# EAGLE design breakout_v0.5 (EAGLE 9.5.0)
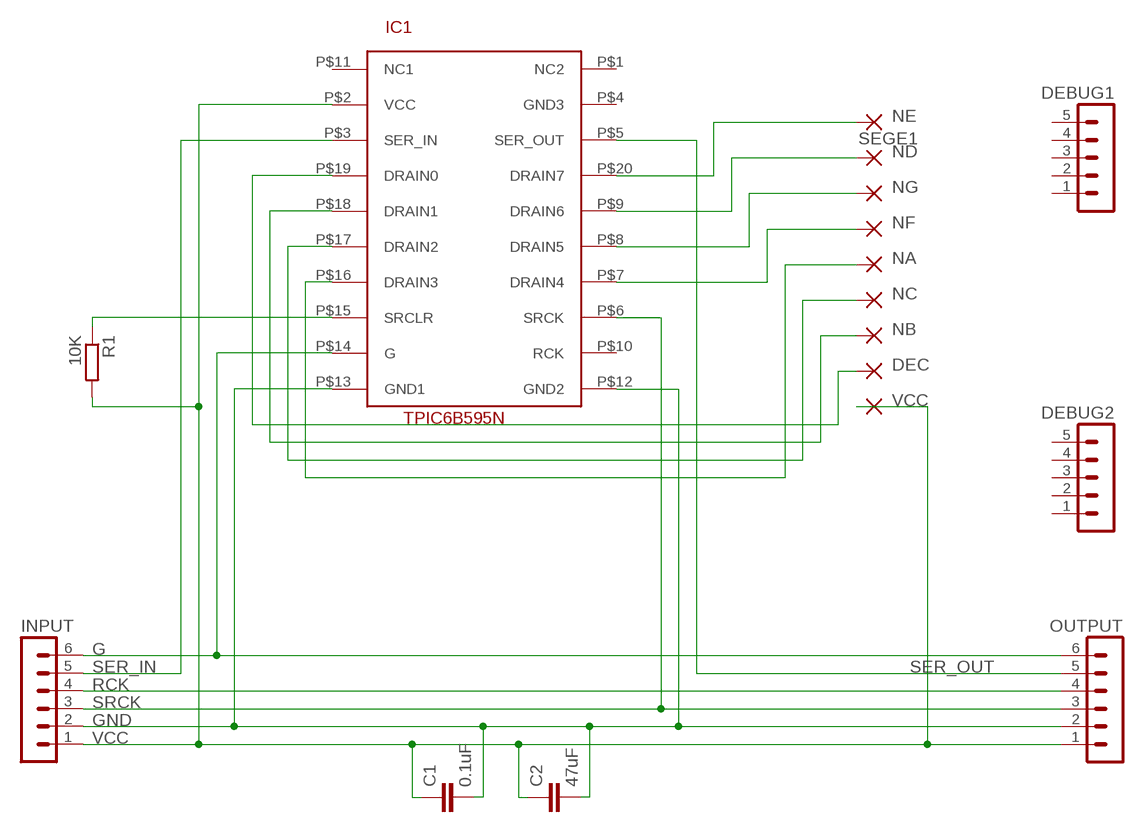
[diagram p0: schematic, sheet 1]

## Parts
C1  0.1uF  RCL_C-EU025-025X050  [RCL_C025-025X050]
C2  47uF  RCL_C-EU025-025X050  [RCL_C025-025X050]
DEBUG1  MA05-1  [MA05-1]
DEBUG2  MA05-1  [MA05-1]
DEC1  1,6/0,8  [1,6/0,8]
INPUT  CON-LSTB_MA06-1  [CON-LSTB_MA06-1]
OUTPUT  CON-LSTB_MA06-1  [CON-LSTB_MA06-1]
R1  10K  RCL_R-EU_0207/7  [RCL_0207/7]
SEGA1  1,6/0,8  [1,6/0,8]
SEGB1  1,6/0,8  [1,6/0,8]
SEGC1  1,6/0,8  [1,6/0,8]
SEGD1  1,6/0,8  [1,6/0,8]
SEGE1  1,6/0,8  [1,6/0,8]
SEGF1  1,6/0,8  [1,6/0,8]
SEGG1  1,6/0,8  [1,6/0,8]
U$1  TPIC6B595N_TPIC6B595NPDIP-20  [TPIC6B595N_PDIP-20]
VCC1  1,6/0,8  [1,6/0,8]

## Nets
DEC: U$1.P$19(DRAIN0) VCC1.1(P)
G: INPUT.6 OUTPUT.6 U$1.P$14(G)
GND [ground]: C1.2 C2.2 INPUT.2 OUTPUT.2 U$1.P$12(GND2) U$1.P$13(GND1)
N$1: R1.1 U$1.P$15(SRCLR)
NA: SEGC1.1(P) U$1.P$16(DRAIN3)
NB: DEC1.1(P) U$1.P$18(DRAIN1)
NC: SEGB1.1(P) U$1.P$17(DRAIN2)
ND: SEGG1.1(P) U$1.P$9(DRAIN6)
NE: SEGE1.1(P) U$1.P$20(DRAIN7)
NF: SEGA1.1(P) U$1.P$7(DRAIN4)
NG: SEGF1.1(P) U$1.P$8(DRAIN5)
RCK: INPUT.4 OUTPUT.4
SER_IN: INPUT.5 U$1.P$3(SER_IN)
SER_OUT: OUTPUT.5 U$1.P$5(SER_OUT)
SRCK: INPUT.3 OUTPUT.3 U$1.P$6(SRCK)
VCC [vcc]: C1.1 C2.1 INPUT.1 OUTPUT.1 R1.2 SEGD1.1(P) U$1.P$2(VCC)
Unconnected: DEBUG1.1 DEBUG1.2 DEBUG1.3 DEBUG1.4 DEBUG1.5 DEBUG2.1 DEBUG2.2 DEBUG2.3 DEBUG2.4 DEBUG2.5 U$1.P$1(NC2) U$1.P$4(GND3) U$1.P$10(RCK) U$1.P$11(NC1)

## Library data of the parts
C1 C2 = v0.4:RCL_C-EU: CAPACITOR, European symbol; SPICEPREFIX: C
DEBUG1 DEBUG2 = con-lstb:MA05-1: PIN HEADER; OC_FARNELL: unknown; OC_NEWARK: unknown
DEC1 SEGA1 SEGB1 SEGC1 SEGD1 SEGE1 SEGF1 SEGG1 VCC1 = wirepad:1,6/0,8: THROUGH-HOLE PAD
INPUT OUTPUT = v0.4:CON-LSTB_MA06-1: PIN HEADER; OC_FARNELL: unknown; OC_NEWARK: unknown
R1 = v0.4:RCL_R-EU_: RESISTOR, European symbol; SPICEPREFIX: R
U$1 = v0.4:TPIC6B595N_TPIC6B595N

## Net classes
0 default: width 0.635 mm
1 vcc: width 1.27 mm
2 ground: width 1.27 mm

## Board
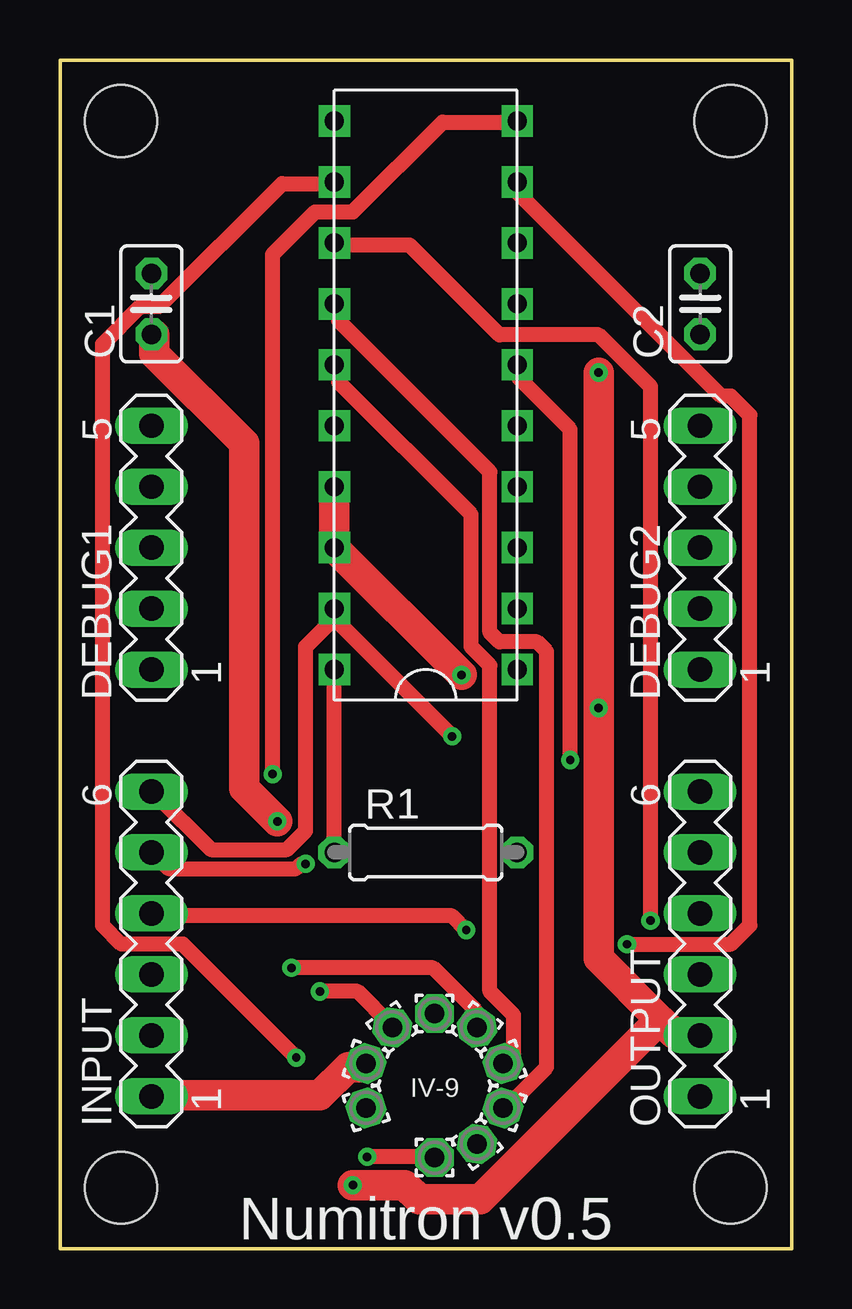
[diagram p1: board, top side]
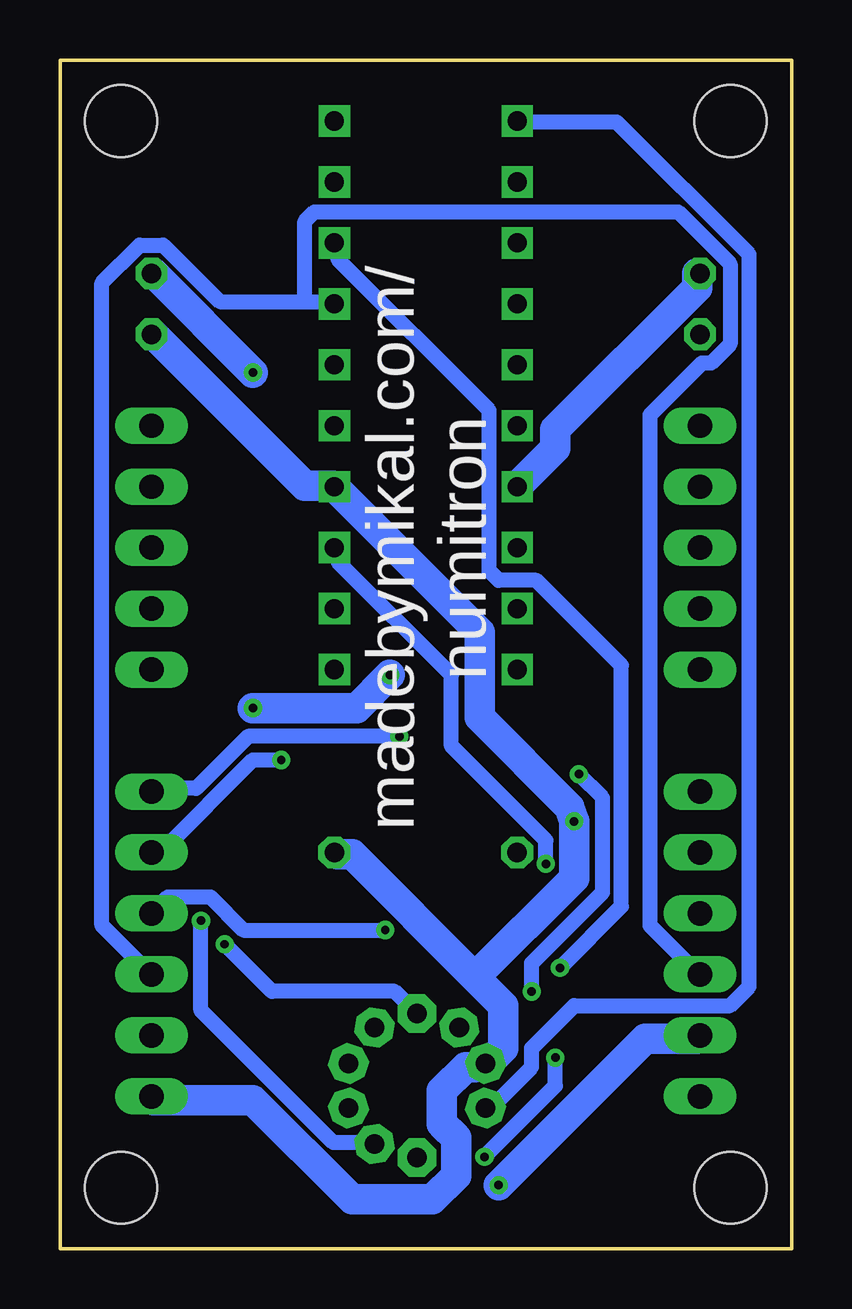
[diagram p2: board, bottom side, seen from below]

Size 30.48 x 49.53 mm. Coordinates in mm from the lower left corner, seen from the top.
Outline: 0,0 0,49.53 30.48,49.53 30.48,0 0,0
Copper layers (1*16): Top 0.035mm / dielectric 1.5mm / Bottom 0.035mm
Design rules "default": minimum track width 6mil, minimum drill 0.35mm, track to track 6mil, track to pad 6mil, pad to pad 6mil, via to via 6mil, smd to smd 6mil, copper to edge 40mil, drill to drill 6mil, minimum pad ring 10mil, minimum via ring 8mil, stop-mask expansion 4mil, vias tented up to drill 0mil, thermal gap 10mil
Holes 3 mm at 2.54,2.54 27.94,2.54 27.94,46.99 2.54,46.99

### Footprints (pad centres in the part's own frame; a part is rotated, then mirrored left to right if it is on the bottom)
RCL_C025-025X050 = drill 0.813 octagon: 1 -1.27,0; 2 1.27,0
MA05-1 = drill 1.016 long: 1 -5.08,0; 2 -2.54,0; 3 0,0; 4 2.54,0; 5 5.08,0
1,6/0,8 = drill 0.813 pad 1.6 octagon: 1 0,0
CON-LSTB_MA06-1 = drill 1.016 long: 1 -6.35,0; 2 -3.81,0; 3 -1.27,0; 4 1.27,0; 5 3.81,0; 6 6.35,0
RCL_0207/7 = drill 0.813 octagon: 1 -3.81,0; 2 3.81,0
TPIC6B595N_PDIP-20 = drill 0.8 square: P$1 -3.81,1.27; P$2 -3.81,3.81; P$3 -3.81,6.35; P$4 -3.81,8.89; P$5 -3.81,-1.27; P$6 -3.81,-3.81; P$7 -3.81,-6.35; P$8 -3.81,-8.89; P$9 -3.81,-11.43; P$10 -3.81,11.43; P$11 3.81,1.27; P$12 3.81,3.81; P$13 3.81,6.35; P$14 3.81,8.89; P$15 3.81,11.43; P$16 3.81,-1.27; P$17 3.81,-3.81; P$18 3.81,-6.35; P$19 3.81,-8.89; P$20 3.81,-11.43

### Placement (x,y rotation side)
C1  3.81,39.37 90 top
C2  26.67,39.37 90 top
DEBUG1  3.81,29.21 90 top
DEBUG2  26.67,29.21 90 top
DEC1  17.37,4.37 306 top
INPUT  3.81,12.7 90 top
OUTPUT  26.67,12.7 90 top
R1  15.24,16.51 0 top
SEGA1  17.37,9.22 144 top
SEGB1  18.46,5.87 342 top
SEGC1  18.46,7.72 18 top
SEGD1  12.75,7.72 162 top
SEGE1  12.75,5.87 198 top
SEGF1  15.61,9.79 90 top
SEGG1  13.84,9.22 126 top
U$1  15.24,35.56 180 top
VCC1  15.61,3.79 270 top

### Tracks (layer width: path | path; a pad name or v marks a point on that pad's centre or on a via)
DEC  (via drill 0.35)
  Top 0.635: v9.84,7.96 5.12,12.69 2.56,12.69 1.77,13.47 1.77,37.69 3.35,39.26 4.13,39.26 9.25,44.38 11.42,44.38 U$1.P$19 | v12.79,3.83 15.55,3.83 VCC1.1
  Bottom 0.635: v9.84,7.96 9.84,6.78 v12.79,3.83
G  (via drill 0.35)
  Top 0.635: INPUT.6 3.94,18.99 6.3,16.62 9.45,16.62 10.24,17.41 10.24,25.09 11.42,26.27 11.42,26.66 U$1.P$14 11.61,26.07 v16.34,21.35
  Bottom 0.635: v16.34,21.35 22.64,21.35 24.8,19.18 26.57,19.18 OUTPUT.6
GND  (via drill 0.35)
  Top 1.27: U$1.P$12 11.42,31.59 11.42,29.22 U$1.P$13 v16.73,23.91 | v22.44,36.51 v22.44,22.53 22.44,12.1 25,9.54 | 25,9.54 25.59,8.95 26.57,8.95 OUTPUT.2 | v12.21,2.65 14.37,2.65 14.96,2.06 17.52,2.06 25,9.54
  Bottom 1.27: C1.2 3.94,40.64 3.94,40.05 9.84,34.14 9.84,33.36 11.42,31.78 U$1.P$12 | v22.44,36.51 26.57,40.64 C2.2 | v12.21,2.65 6.1,8.75 3.94,8.75 INPUT.2 | v16.73,23.91 18.11,22.53 v22.44,22.53
N$1
  Top 0.635: U$1.P$15 11.42,24.11 11.42,16.62 R1.1
NA
  Top 0.635: U$1.P$16 11.61,36.7 11.61,36.11 17.13,30.6 17.13,25.09 17.91,24.3 17.91,10.72 18.9,9.73 18.9,8.16 18.5,7.77 SEGC1.1
NB  (via drill 0.35)
  Top 0.635: v24.61,13.67 24.61,35.92 22.44,38.08 18.31,38.08 14.57,41.82 11.61,41.82 U$1.P$18
  Bottom 0.635: v24.61,13.67 24.61,9.93 19.09,4.42 17.52,4.42 DEC1.1
NC
  Top 0.635: U$1.P$17 11.61,39.26 11.61,38.67 17.91,32.37 17.91,25.68 18.31,25.29 19.88,25.29 20.28,24.89 20.28,7.57 18.5,5.8 SEGB1.1
ND  (via drill 0.35)
  Top 0.635: v8.86,19.77 8.86,41.43 10.63,43.2 12.21,43.2 15.95,46.94 18.9,46.94 U$1.P$9 | v10.83,10.72 12.4,10.72 13.78,9.34 SEGG1.1
  Bottom 0.635: v8.86,19.77 7.87,18.79 7.87,14.85 10.83,11.9 v10.83,10.72
NE
  Bottom 0.635: U$1.P$20 11.42,46.94 7.28,46.94 1.77,41.43 1.77,10.92 2.56,10.13 9.05,10.13 10.83,8.36 10.83,7.57 12.6,5.8 SEGE1.1
NF  (via drill 0.35)
  Top 0.635: v9.65,11.7 15.55,11.7 17.32,9.93 17.32,9.34 SEGA1.1
  Bottom 0.635: v9.65,11.7 7.09,14.26 7.09,24.3 10.63,27.84 12.21,27.84 12.6,28.24 12.6,34.93 18.9,41.23 18.9,41.82 U$1.P$7
NG  (via drill 0.35)
  Top 0.635: v23.62,12.69 27.95,12.69 28.74,13.47 28.74,34.74 27.95,35.52 27.56,35.52 19.09,43.99 19.09,44.38 U$1.P$8
  Bottom 0.635: v23.62,12.69 21.65,10.72 16.54,10.72 15.75,9.93 SEGF1.1
RCK  (via drill 0.35)
  Top 0.635: v16.93,13.28 16.34,13.87 3.94,13.87 INPUT.4
  Bottom 0.635: v16.93,13.28 22.84,13.28 24.21,14.66 25.98,14.66 OUTPUT.4
SER_IN  (via drill 0.35)
  Top 0.635: v10.24,16.03 10.04,16.03 9.84,15.84 4.53,15.84 3.94,16.43 INPUT.5
  Bottom 0.635: v10.24,16.03 10.24,17.02 14.17,20.95 14.17,23.91 18.9,28.63 18.9,29.03 U$1.P$3
SER_OUT  (via drill 0.35)
  Top 0.635: v21.26,20.36 21.26,34.14 19.09,36.31 19.09,36.7 U$1.P$5
  Bottom 0.635: v21.26,20.36 22.44,20.36 26.18,16.62 26.57,16.62 OUTPUT.5
SRCK
  Bottom 0.635: 20.28,39.46 23.82,39.46 26.18,41.82 27.16,41.82 28.74,40.25 28.74,13.47 26.77,11.51 OUTPUT.3 | 20.28,39.46 19.09,39.46 U$1.P$6 | 20.28,39.46 20.28,42.8 19.88,43.2 4.72,43.2 2.56,41.03 2.56,37.69 3.35,36.9 3.74,36.9 5.91,34.74 5.91,13.47 3.94,11.51 INPUT.3
VCC  (via drill 0.35)
  Top 1.27: v9.05,17.8 7.68,19.18 7.68,33.55 3.94,37.29 3.94,38.08 C1.1 | INPUT.1 3.94,6.39 10.83,6.39 12.01,7.57 12.6,7.57 SEGD1.1
  Bottom 1.27: C2.1 26.57,38.08 20.28,31.78 19.09,31.78 U$1.P$2 18.7,31.39 12.99,25.68 12.99,22.14 9.25,18.4 v9.05,17.8 9.05,15.44 13.19,11.31 | 13.19,11.31 12.01,10.13 12.01,8.36 12.6,7.77 SEGD1.1 13.19,7.57 13.58,7.57 14.57,6.59 14.57,5.21 13.98,4.62 13.98,3.04 14.96,2.06 18.31,2.06 22.44,6.19 26.57,6.19 OUTPUT.1 | 13.19,11.31 18.31,16.43 18.9,16.43 R1.2

### Text on the board
tPlace: IV-9 | Numitron v0.5
bPlace: madebymikal.com/ / numitron